# EAGLE design mymote-core (EAGLE 8.3.2)
PROJECT_AUTHOR: TINKERMAN <xose.perez@gmail.com>; PROJECT_LICENSE: CC-SA-BY 3.0; PROJECT_NAME: MYMOTE - CORE; PROJECT_VERSION: 0.3.20180204
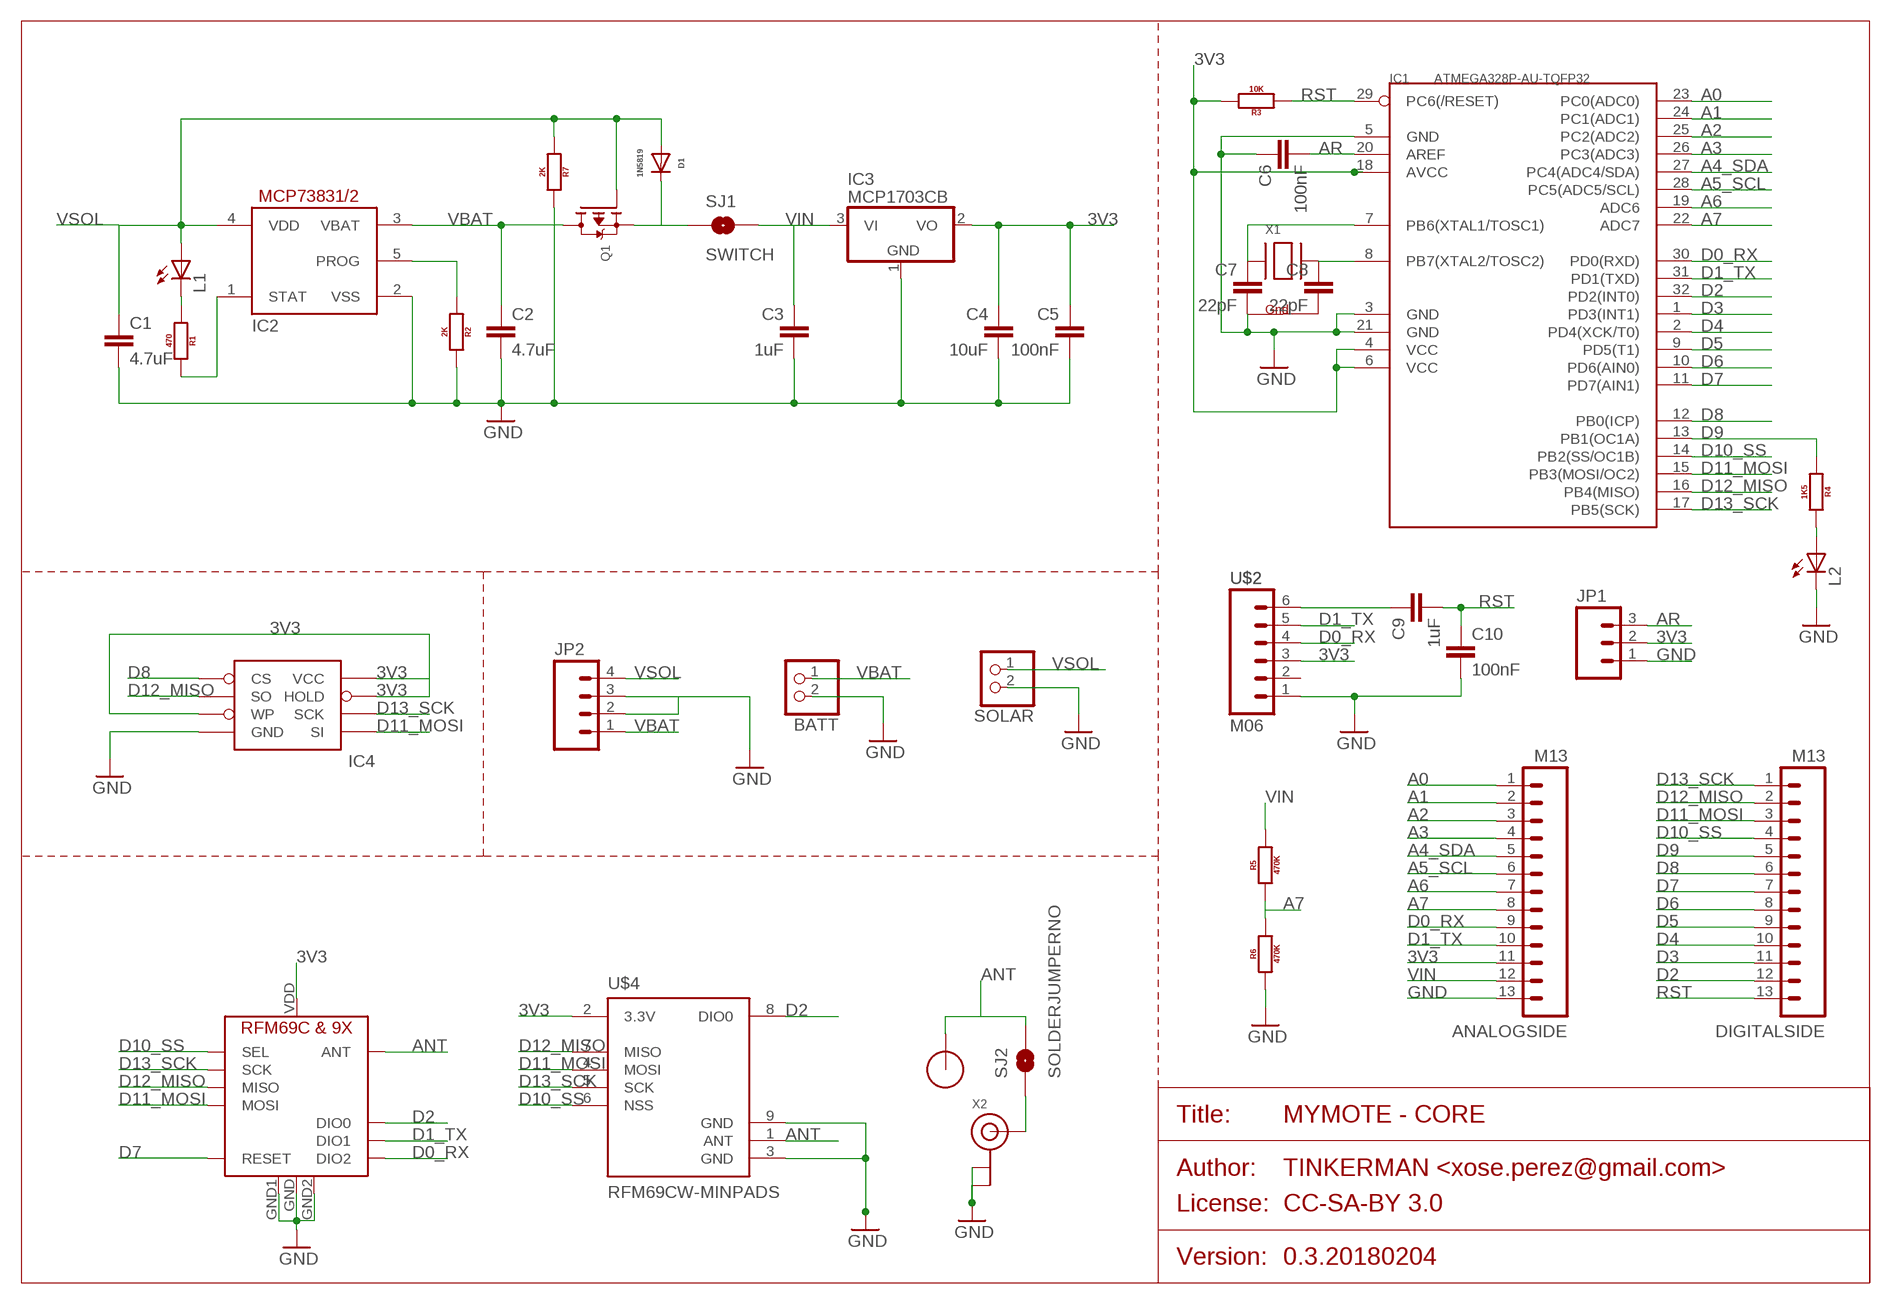
[diagram p0: schematic, sheet 1]

## Parts
ANALOGSIDE  M13  [1X13_NO_SILK]
BATT  JST_2PIN-SMT-RA  [JST-PH-2-SMT-RA]
C1  4.7uF  C-EU0805  [0805]
C2  4.7uF  C-EU0805  [0805]
C3  1uF  C-EU0805  [0805]
C4  10uF  C-EU0805  [0805]
C5  100nF  C-EU0805  [0805]
C6  100nF  C-EU0805  [0805]
C7  22pF  C-EU0805  [0805]
C8  22pF  C-EU0805  [0805]
C9  1uF  C-EU0805  [0805]
C10  100nF  C-EU0805  [0805]
D1  1N5819  DIODE-SMD  [0805_DIODE]
DIGITALSIDE  M13  [1X13_NO_SILK]
IC1  ATMEGA328P-AU-TQFP32  MCU-ATMEGA328P-AU(TQFP32)  [TQFP32-0.8-7X7MM]
IC2  MCP73831/OT  [SOT23-5L]
IC3  MCP1703CB  [SOT23]
IC4  AT25F512BWIDE_5.3MM  [SO08WIDE]
JP1  M03PTH  [1X03]
JP2  M04PTH  [1X04]
L1  LED_0805  [0805_DIODE]
L2  LED_0805  [0805_DIODE]
Q1  MOSFET-PWIDE  [SOT23-WIDE]
R1  470  RESISTOR0805  [0805]
R2  2K  RESISTOR0805  [0805]
R3  10K  RESISTOR0805  [0805]
R4  1K5  RESISTOR0805  [0805]
R5  470K  RESISTOR0805  [0805]
R6  470K  RESISTOR0805  [0805]
R7  2K  RESISTOR0805  [0805]
SJ1  SWITCH  SOLDERJUMPERTRACE-PTH  [SJ_2S-TRACE-PTH]
SJ2  SOLDERJUMPERNO  [SJ_2S-NO]
SOLAR  JST_2PIN-SMT-RA  [JST-PH-2-SMT-RA]
U$1  RFM12B_ANTENNA  [RFM12B-ANTENNA]
U$2  M06  [1X06_NO_SILK]
U$3  RFM69HCW-RFM95  [RFM69HCW-RFM95-MINPADS]
U$4  RFM69CW-MINPADS  [RFM69CW-MINPADS]
X1  XTAL-4-3225  [NX3225]
X2  ANTENNA_U.FL  [U.FL]

## Nets
3V3: ANALOGSIDE.11 C4.1 C5.1 IC1.4(VCC) IC1.6(VCC) IC1.18(AVCC) IC3.2(VO) IC4.3(WP) IC4.7(HOLD) IC4.8(VCC) JP1.2 R3.2 U$2.3 U$3.VDD(VCC) U$4.2(3.3V)
A0: ANALOGSIDE.1 IC1.23(PC0(ADC0))
A1: ANALOGSIDE.2 IC1.24(PC1(ADC1))
A2: ANALOGSIDE.3 IC1.25(PC2(ADC2))
A3: ANALOGSIDE.4 IC1.26(PC3(ADC3))
A4_SDA: ANALOGSIDE.5 IC1.27(PC4(ADC4/SDA))
A5_SCL: ANALOGSIDE.6 IC1.28(PC5(ADC5/SCL))
A6: ANALOGSIDE.7 IC1.19(ADC6)
A7: ANALOGSIDE.8 IC1.22(ADC7) R5.1 R6.2
ANT: SJ2.2 U$1.P$1 U$3.ANT U$4.1(ANT)
AR: C6.2 IC1.20(AREF) JP1.3
D0_RX: ANALOGSIDE.9 IC1.30(PD0(RXD)) U$2.4 U$3.DIO2
D1_TX: ANALOGSIDE.10 IC1.31(PD1(TXD)) U$2.5 U$3.DIO1
D2: DIGITALSIDE.12 IC1.32(PD2(INT0)) U$3.DIO0 U$4.8(DIO0)
D3: DIGITALSIDE.11 IC1.1(PD3(INT1))
D4: DIGITALSIDE.10 IC1.2(PD4(XCK/T0))
D5: DIGITALSIDE.9 IC1.9(PD5(T1))
D6: DIGITALSIDE.8 IC1.10(PD6(AIN0))
D7: DIGITALSIDE.7 IC1.11(PD7(AIN1)) U$3.RESET
D8: DIGITALSIDE.6 IC1.12(PB0(ICP)) IC4.1(CS)
D9: DIGITALSIDE.5 IC1.13(PB1(OC1A)) R4.1
D10_SS: DIGITALSIDE.4 IC1.14(PB2(SS/OC1B)) U$3.NSS(SEL) U$4.6(NSS)
D11_MOSI: DIGITALSIDE.3 IC1.15(PB3(MOSI/OC2)) IC4.5(SI) U$3.MOSI U$4.4(MOSI)
D12_MISO: DIGITALSIDE.2 IC1.16(PB4(MISO)) IC4.2(SO) U$3.MISO U$4.7(MISO)
D13_SCK: DIGITALSIDE.1 IC1.17(PB5(SCK)) IC4.6(SCK) U$3.SCK U$4.5(SCK)
GND [power]: ANALOGSIDE.13 BATT.2 C1.2 C2.2 C3.2 C4.2 C5.2 C6.1 C7.2 C10.2 IC1.3(GND) IC1.5(GND) IC1.21(GND) IC2.2(VSS) IC3.1(GND) IC4.4(GND) JP1.1 JP2.2 JP2.3 L2.C R2.2 R6.1 R7.2 SOLAR.2 U$2.1 U$3.GND U$3.GND1 U$3.GND2 U$4.3(GND) U$4.9(GND) X1.4(G1) X2.1(GND) X2.2(GND)
N$1: L2.A R4.2
N$2: L1.C R1.1
N$3: IC2.5(PROG) R2.1
N$4: IC2.1(STAT) R1.2
N$5: C7.1 IC1.7(PB6(XTAL1/TOSC1)) X1.1(X1)
N$7: C9.1 U$2.6
N$8: SJ2.1 X2.3(SIGNAL)
N$9: D1.C Q1.2(S) SJ1.1
N$11: C8.1 IC1.8(PB7(XTAL2/TOSC2)) X1.3(X2)
N$12: C8.2 X1.2(G2)
RST: C9.2 C10.1 DIGITALSIDE.13 IC1.29(PC6(/RESET)) R3.1
VBAT: BATT.1 C2.1 IC2.3(VBAT) JP2.1 Q1.3(D)
VIN: ANALOGSIDE.12 C3.1 IC3.3(VI) R5.2 SJ1.2
VSOL: C1.1 D1.A IC2.4(VDD) JP2.4 L1.A Q1.1(G) R7.1 SOLAR.1
Unconnected: U$2.2

## Library data of the parts
ANALOGSIDE DIGITALSIDE = xose:M13
BATT SOLAR = adafruit:JST_2PIN: JST 2-Pin Connectors of various flavors SMT-RA (S2B-PH-SM4) 4UConnector #17311 SMT (B2B-PH-SM4) THM-RA (S2B-PH) THM (B2B-PH)
C1-C10 = xose:C-EU: CAPACITOR, European symbol
D1 = xose:DIODE
IC1 = Seeed-IC-2016:MCU-ATMEGA328P-AU(TQFP32): 310010049; MPN: ATMEGA328P-AU
IC2 = adafruit:MCP73831: MCP73831/2 Miniature Single-Cell, Fully Integrated Li-Ion, Li-Polymer Charge Management Controllers. Nice and small simple lipoly charge controller, with adjustable current and status output (LED) http://www.ladyada.net/library/pcb/eaglelibrary.html
IC3 = xose:MCP1703: 250 mA, 16V, Low Quiescent Current LDO Regulator Source: http://ww1.microchip.com/downloads/en/DeviceDoc/22049b.pdf
IC4 = xose:AT25F512B: 4-Mbit SPI flash memory
JP1 = xose:M03: Header 3 Standard 3-pin 0.1" header. Use with straight break away headers (SKU : PRT-00116), right angle break away headers (PRT-00553), swiss pins (PRT-00743), machine pins (PRT-00117), and female headers (PRT-00115). Molex polarized connector foot print use with SKU : PRT-08232 with associated crimp pins and housings.
JP2 = xose:M04: Header 4 Standard 4-pin 0.1" header. Use with straight break away headers (SKU : PRT-00116), right angle break away headers (PRT-00553), swiss pins (PRT-00743), machine pins (PRT-00117), and female headers (PRT-00115). Molex polarized connector foot print use with SKU : PRT-08231 with associated crimp pins and housings. 1MM SMD Version SKU: PRT-10208
L1 L2 = xose:LED: LED OSRAM: - CHIPLED LG R971, LG N971, LY N971, LG Q971, LY Q971, LO R971, LY R971 LH N974, LH R974 LS Q976, LO Q976, LY Q976 LO Q996 - Hyper CHIPLED LW Q18S LB Q993, LB Q99A, LB R99A - SideLED LS A670, LO A670, LY A670, LG A670, LP A670 LB A673, LV A673, LT A673, LW A673 LH A674 LY A675 LS A676, LA A676, LO A676, LY A676, LW A676 LS A679, LY A679, LG A679 - Hyper Micro SIDELED® LS Y876, LA Y876, LO Y876, LY Y876 LT Y87S - SmartLED LW L88C, LW L88S LB L89C, LB L89S, LG L890 LS L89K, LO L89K, LY L89K LS L896, LA L896, LO L896, LY L896 - TOPLED LS T670, LO T670, LY T670, LG T670, LP T670 LSG T670, LSP T670, LSY T670, LOP T670, LYG T670 LG T671, LOG T671, LSG T671 LB T673, LV T673, LT T673, LW T673 LH T674 LS T676, LA T676, LO T676, LY T676, LB T676, LH T676, LSB T676, LW T676 LB T67C, LV T67C, LT T67C, LS T67K, LO T67K, LY T67K, LW E67C LS E67B, LA E67B, LO E67B, LY E67B, LB E67C, LV E67C, LT E67C LW T67C LS T679, LY T679, LG T679 LS T770, LO T770, LY T770, LG T770, LP T770 LB T773, LV T773, LT T773, LW T773 LH T774 LS E675, LA E675, LY E675, LS T675 LS T776, LA T776, LO T776, LY T776, LB T776 LHGB T686 LT T68C, LB T68C - Hyper Mini TOPLED® LB M676 - Mini TOPLED Santana® LG M470 LS M47K, LO M47K, LY M47K Source: http://www.osram.convergy.de LUXEON: - LUMILED® LXK2-PW12-R00, LXK2-PW12-S00, LXK2-PW14-U00, LXK2-PW14-V00 LXK2-PM12-R00, LXK2-PM12-S00, LXK2-PM14-U00 LXK2-PE12-Q00, LXK2-PE12-R00, LXK2-PE12-S00, LXK2-PE14-T00, LXK2-PE14-U00 LXK2-PB12-K00, LXK2-PB12-L00, LXK2-PB12-M00, LXK2-PB14-N00, LXK2-PB14-P00, LXK2-PB14-Q00 LXK2-PR12-L00, LXK2-PR12-M00, LXK2-PR14-Q00, LXK2-PR14-R00 LXK2-PD12-Q00, LXK2-PD12-R00, LXK2-PD12-S00 LXK2-PH12-R00, LXK2-PH12-S00 LXK2-PL12-P00, LXK2-PL12-Q00, LXK2-PL12-R00 Source: www.luxeon.com KINGBRIGHT: KA-3528ASYC Source: www.kingbright.com
Q1 = xose:MOSFET-P: P-Channel Mosfet LEGEND VDS: Voltage Drain-Source ID: Drain Current RDS(ON): Drain-Source On-State Resistance VGS(TH): Gate-Source Threshold Voltage CISS: Drain-Source Input Capacitance SOT-23 Name VDS ID RDS(ON) VGS(TH) CISS Order Number IRLML5103 30V 760mA 600 mOhm -- 75pF @ 25V Digikey: IRLML5103PBFCT-ND IRLML6401 12V 4.3A 50 mOhm 950mV @ 250µA 830pF @ 10V Digikey: IRLML6401PBFTR-ND NTR0202PL 20V 400mA 800 mOhm 2.3V @ 250uA 70pF @ 5V Digikey: NTR0202PLT1GOSTR-ND NTR4101PT1G 20V 1.8A 85 mOhm 1.2V @ 250uA 675pF @ 10V Digikey: NTR4101PT1GOSCT-ND DMP2004K 20V 600mA 900 mOhm 1V @ 250uA 175pF @ 16V Digikey: DMP2004KDICT-ND PMV65XP 20V 3.9A 76 mOhm 950mV @ 1mA 725pF @ 20V Digikey: 568-2358-2-ND TO-252 Name VDS ID RDS(ON) VGS(TH) CISS Order Number AOD417 30V 25A 34 mOhm 3V @ 250µA 920pF @ 15V Digikey: 785-1106-2-ND
R1-R7 = xose:RESISTOR: Generic EU resistor symbol
SJ1 SJ2 = xose:SOLDERJUMPER: Solder Jumper Standard SMD solder jumper. Used to automate production. Two varients : Normally Open and Normally Closed are the same, but have different paste layers. NC will have a large amount of paste and should jumper during reflow.
U$1 = LowPowerLab:RFM12B_ANTENNA
U$2 = xose:M06
U$3 = xose:RFM69HCW-RFM95
U$4 = xose:RFM69CW-MINPADS
X1 = adafruit:XTAL-4: Classic 4-pin 3.2 x 2.5mm crystal
X2 = adafruit:ANTENNA_U.FL: U.FL Antenna Connector

## Net classes
1 power: width 0.381 mm, clearance 0.254 mm

## Board
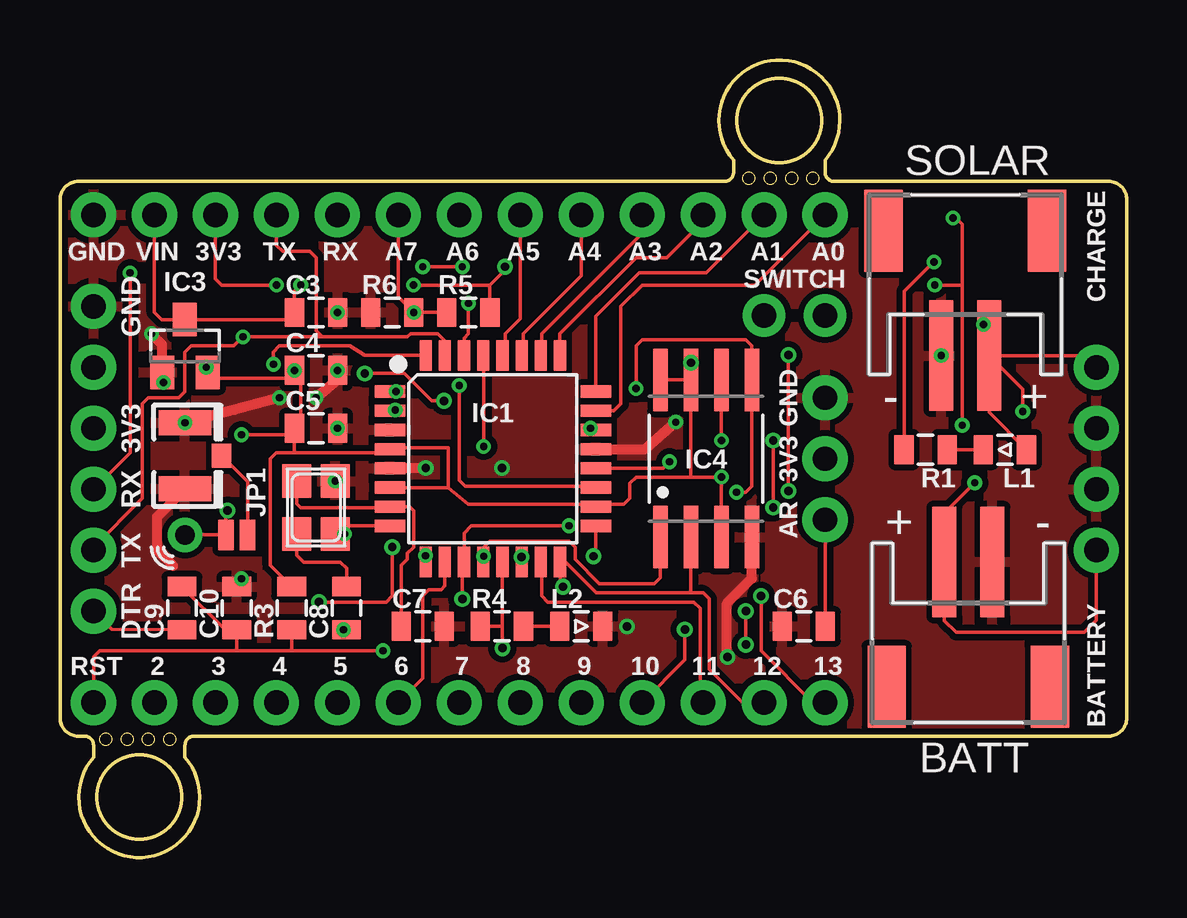
[diagram p1: board, top side]
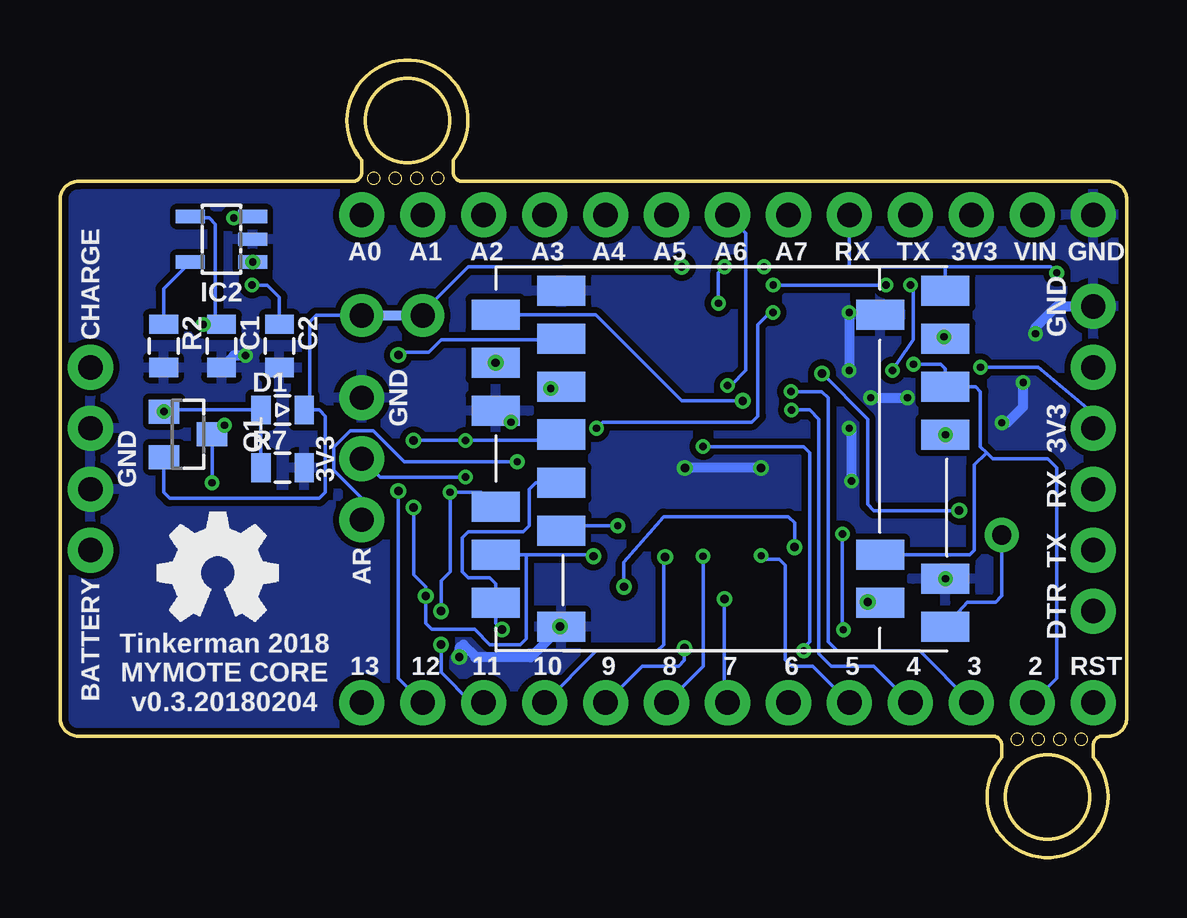
[diagram p2: board, bottom side, seen from below]

Size 44.45 x 33.23 mm. Coordinates in mm from the lower left corner, seen from the top.
Outline: 0.71,5.06 0.76,5.06
Outline: 0.76,28.17 0.71,28.17
Outline: 0,5.77 0,5.82
Outline: 0,27.41 0,27.46
Outline: 0,5.82 0,27.41
Outline: 0,27.41 arc-90 0.76,28.17
Outline: 0.76,5.06 1.02,5.06 arc-90 1.4,4.68 1.4,4.17 arc262 5.21,4.17 5.21,4.68 arc-90 5.59,5.06 43.69,5.06 arc90 44.45,5.82 44.45,27.41 arc90 43.69,28.17 32.26,28.17 arc-90 31.88,28.55 31.88,29.06 arc262 28.07,29.06 28.07,28.55 arc-90 27.69,28.17 0.76,28.17
Outline: 0.76,5.06 arc-90 0,5.82
Outline: circle at 3.3,2.52 radius 1.75
Outline: circle at 1.91,4.93 radius 0.25
Outline: circle at 2.79,4.93 radius 0.25
Outline: circle at 3.68,4.93 radius 0.25
Outline: circle at 29.97,30.71 radius 1.75
Outline: circle at 31.37,28.3 radius 0.25
Outline: circle at 30.48,28.3 radius 0.25
Outline: circle at 29.59,28.3 radius 0.25
Outline: circle at 4.57,4.93 radius 0.25
Outline: circle at 28.7,28.3 radius 0.25
Copper layers (1*16): Top 0.035mm / dielectric 1.5mm / Bottom 0.035mm
Design rules "seedstudio-2layer": minimum track width 6mil, minimum drill 12mil, track to track 6mil, track to pad 6mil, pad to pad 6mil, via to via 6mil, smd to smd 0mil, copper to edge 10mil, drill to drill 10mil, minimum pad ring 10mil, minimum via ring 6mil, stop-mask expansion 2mil, vias tented up to drill 100mil, thermal gap 10mil

### Footprints (pad centres in the part's own frame; a part is rotated, then mirrored left to right if it is on the bottom)
1X13_NO_SILK = drill 1.016 pad 1.88: 1 0,0; 2 2.54,0; 3 5.08,0; 4 7.62,0; 5 10.16,0; 6 12.7,0; 7 15.24,0; 8 17.78,0; 9 20.32,0; 10 22.86,0; 11 25.4,0; 12 27.94,0; 13 30.48,0
JST-PH-2-SMT-RA = smd 1 x 4.6: 1 1,-3.7; 2 -1,-3.7 | smd 1.6 x 3.4: NC1 -3.4,1.5; NC2 3.4,1.5
0805 = smd 0.8 x 1.2: 1 -0.9,0; 2 0.9,0
0805_DIODE = smd 0.8 x 1.2: A -0.9,0; C 0.9,0
TQFP32-0.8-7X7MM = smd 1.27 x 0.508: 1 -4.293,2.8; 2 -4.293,2; 3 -4.293,1.2; 4 -4.293,0.4; 5 -4.293,-0.4; 6 -4.293,-1.2; 7 -4.293,-2; 8 -4.293,-2.8; 17 4.293,-2.8; 18 4.293,-2; 19 4.293,-1.2; 20 4.293,-0.4; 21 4.293,0.4; 22 4.293,1.2; 23 4.293,2; 24 4.293,2.8 | smd 0.508 x 1.27: 9 -2.8,-4.293; 10 -2,-4.293; 11 -1.2,-4.293; 12 -0.4,-4.293; 13 0.4,-4.293; 14 1.2,-4.293; 15 2,-4.293; 16 2.8,-4.293; 25 2.8,4.293; 26 2,4.293; 27 1.2,4.293; 28 0.4,4.293; 29 -0.4,4.293; 30 -1.2,4.293; 31 -2,4.293; 32 -2.8,4.293
SOT23-5L = smd 0.55 x 1.2: 1 -0.95,-1.3; 2 0,-1.3; 3 0.95,-1.3; 4 0.95,1.3; 5 -0.95,1.3
SOT23 = smd 1 x 1.4: 1 -0.95,-1.1; 2 0.95,-1.1; 3 0,1.1
SO08WIDE = smd 0.61 x 2.6: 1 -1.905,-3.269; 2 -0.635,-3.269; 3 0.635,-3.269; 4 1.905,-3.269; 5 1.905,3.286; 6 0.635,3.286; 7 -0.635,3.286; 8 -1.905,3.286
1X03 = drill 1.016 pad 1.88: 1 0,0; 2 2.54,0; 3 5.08,0
1X04 = drill 1.016 pad 1.88: 1 0,0; 2 2.54,0; 3 5.08,0; 4 7.62,0
SOT23-WIDE = smd 1 x 1.27: 1 -0.95,-1; 2 0.95,-1; 3 0,1
SJ_2S-TRACE-PTH = drill 1.016 pad 1.778: 1 -1.27,0; 2 1.27,0 | smd 1.27 x 0.381 bottom: P$1 0,0
SJ_2S-NO = smd 0.635 x 1.27: 1 -0.45,0; 2 0.45,0
RFM12B-ANTENNA = drill 0.8 pad 1.422: P$1 0,0
1X06_NO_SILK = drill 1.016 pad 1.88: 1 0,0; 2 2.54,0; 3 5.08,0; 4 7.62,0; 5 10.16,0; 6 12.7,0
RFM69HCW-RFM95-MINPADS = smd 2 x 1.27: ANT 5.777,-7; DIO0 5.777,3; DIO1 5.779,5; DIO2 5.779,7; GND 5.777,-5; GND1 -10.223,7; GND2 -10.23,-7; MISO -10.23,5; MOSI -10.225,3; NSS -10.223,-1; RESET -10.223,-3; SCK -10.23,1.012; VDD 5.777,1
RFM69CW-MINPADS = smd 2 x 1.27: 1 -8.008,6; 2 -8.008,4; 3 -8.008,2; 4 -8.008,-2; 5 -8.008,-4; 6 -8.008,-6; 7 8.008,-6; 8 8.008,-4; 9 8.008,6
NX3225 = smd 1.4 x 1.2: 1 -1.1,-0.8; 2 1.1,-0.8; 3 1.1,0.8; 4 -1.1,0.8
U.FL = smd 2.2 x 1.05: 1 0,1.375; 2 0,-1.375 | smd 0.8 x 1: 3 1.525,0

### Placement (x,y rotation side)
ANALOGSIDE  31.88,26.77 180 top
BATT  37.85,8.61 180 top
C1  37.72,21.31 270 bottom
C2  35.31,21.31 270 bottom
C3  10.67,22.71 0 top
C4  10.67,20.3 0 top
C5  10.67,17.88 0 top
C6  30.99,9.63 0 top
C7  15.11,9.63 0 top
C8  11.94,10.39 90 top
C9  5.08,10.39 90 top
C10  7.37,10.39 90 top
D1  35.18,18.65 0 bottom
DIGITALSIDE  31.88,6.45 180 top
IC1  18.03,16.61 0 top
IC2  37.72,25.76 90 bottom
IC3  5.21,21.31 0 top
IC4  26.92,16.61 0 top
JP1  31.88,19.15 270 top
JP2  43.18,12.8 90 top
L1  39.37,17 180 top
L2  21.72,9.63 0 top
Q1  39.12,17.63 270 bottom
R1  36.07,17 180 top
R2  40.13,21.31 270 bottom
R3  9.65,10.39 90 top
R4  18.41,9.63 0 top
R5  17.02,22.71 0 top
R6  13.84,22.71 0 top
R7  35.18,16.23 0 bottom
SJ1  30.61,22.58 180 top
SJ2  7.37,13.44 180 top
SOLAR  37.72,24.62 0 top
U$1  5.21,13.44 0 top
U$2  1.4,22.96 270 top
U$3  13.34,16.61 0 bottom
U$4  18.29,16.61 0 bottom
X1  10.67,14.58 270 top
X2  5.21,16.74 0 top

### Tracks (layer width: path | path; a pad name or v marks a point on that pad's centre or on a via)
3V3  (via drill 0.3, 0.35)
  Top 0.152: IC4.3 v27.56,15.85 26.29,15.85 | IC4.8 IC4.7 | 26.29,15.85 24,15.85 23.75,15.6 23.75,14.96 23.5,14.71 22.42,14.71 IC1.18 22.23,14.71 17.02,14.71 16.19,15.41 | 16.19,15.41 IC1.6 | IC1.4 13.85,17.12 | 16.19,15.41 16.19,17.07 13.79,17.07 IC1.4 | IC1.4 13.72,16.87 | v6.1,20.42 6.16,20.1 IC3.2 6.41,19.96 9.68,19.96 C4.1 9.77,20.05 10.03,19.79 10.03,18.15 C5.1 | R3.2 8.76,12.18 8.76,16.61 9.02,16.87 9.78,16.87 | 13.61,16.88 IC1.4 | IC1.4 13.6,16.87 9.78,16.87 | C5.1 9.77,16.88 9.78,16.87 | U$3.VDD 9.5,17.61 C5.1 | ANALOGSIDE.11 6.48,24.11 6.73,23.85 v9.02,23.85 | IC4.7 26.29,15.85 | IC4.7 U$4.2
  Bottom 0.152: U$2.3 1.4,18.52 3.68,20.42 v6.1,20.42 | v9.02,23.85 8.89,23.73 8.89,21.58 C4.1 | v27.56,15.85 31.11,15.85 JP1.2
  other vias: 7.56,17.61 9.77,20.3 26.3,20.61
A0
  Top 0.152: IC1.23 23.08,18.61 23.37,18.9 23.37,22.96 24.26,23.85 28.96,23.85 ANALOGSIDE.1
A1
  Top 0.152: IC1.24 22.33,22.56 24.13,24.36 26.92,24.36 ANALOGSIDE.2
A2
  Top 0.152: IC1.25 20.83,21.82 24,25 25.27,25 26.8,26.52 ANALOGSIDE.3
A3
  Top 0.152: IC1.26 20.07,20.94 20.07,21.82 24.26,26.01 ANALOGSIDE.4
A4_SDA
  Top 0.152: IC1.27 19.3,20.98 19.3,21.82 21.72,24.23 ANALOGSIDE.5
A5_SCL
  Top 0.152: IC1.28 18.54,21.02 18.54,21.82 19.18,22.46 ANALOGSIDE.6
A6  (via drill 0.3)
  Top 0.152: IC1.19 22.41,15.41 22.35,15.47 16.89,15.47 16.64,15.73 v16.64,19.66
  Bottom 0.152: ANALOGSIDE.7 15.88,26.01 15.88,20.3 16.51,19.66 v16.64,19.66
A7  (via drill 0.3)
  Top 0.152: R5.1 R6.2 14.1,23.36 ANALOGSIDE.8 | v22.1,17.88 22.27,17.88 IC1.22
  Bottom 0.152: v22.1,17.88 21.84,18.14 15.62,18.14 15.37,18.39 15.37,22.2 14.86,22.71 R6.2
  other vias: 14.74,22.71
ANT  (via drill 0.35)
  Top 0.152: U$1.P$1 SJ2.2 6.92,14.39 v6.99,14.46 | v16,19.03 15.49,19.03 14.35,20.17 v12.7,20.17
  Bottom 0.152: U$3.ANT 6.65,10.65 5.46,10.65 5.21,10.9 U$1.P$1 | U$4.1 22.13,22.61 18.54,19.03 v16,19.03 | v6.99,14.46 10.54,14.46 10.79,14.71 10.79,18.27 v12.7,20.17
AR  (via drill 0.3)
  Top 0.152: JP1.3 31.88,9.64 C6.2 | IC1.20 25.13,16.21 v25.4,16.49
  Bottom 0.152: v25.4,16.49 30.1,16.49 31.39,17.78 32.36,17.78 33.05,17.1 33.05,16.13 31.88,14.96 JP1.3
D0_RX  (via drill 0.3)
  Top 0.152: IC1.30 16.83,21.64 17.02,21.82 v17.02,23.09 | v16.76,24.62 v15.11,24.62 | v2.92,24.36 2.92,16.87 U$2.4
  Bottom 0.152: v17.02,23.09 17.02,24.36 v16.76,24.62 | v2.92,24.36 3.17,24.62 7.56,24.62 | 7.56,24.62 11.56,24.62 | 11.56,24.62 v15.11,24.62 | ANALOGSIDE.9 11.56,24.62 | U$3.DIO2 7.56,24.62
D1_TX  (via drill 0.3)
  Top 0.152: IC1.31 16.03,21.54 15.75,21.82 14.61,21.82 14.48,21.69 10.92,21.69 | 10.92,21.69 10.67,21.95 10.67,25 10.41,25.25 9.27,25.25 9.02,25.5 ANALOGSIDE.10 | 10.92,21.69 v7.62,21.69 7.24,21.31 5.46,21.31 5.21,21.06 5.21,19.41 4.95,19.15 3.68,19.15 3.43,18.9 3.43,14.96 1.4,12.93 U$2.5
  Bottom 0.152: U$3.DIO1 7.56,21.63 v7.62,21.69
D2  (via drill 0.3)
  Top 0.152: IC1.32 15.21,20.93 12.7,20.93 12.06,21.31 9.14,21.31 8.89,21.06 v8.89,20.55
  Bottom 0.152: U$3.DIO0 8.14,19.66 | 7,19.66 U$3.DIO0 | DIGITALSIDE.12 2.92,7.47 2.92,16.23 3.3,16.61 5.59,16.61 5.84,16.87 | U$3.DIO0 6.3,19.61 6.1,19.41 6.1,17.12 5.84,16.87 | U$3.DIO0 7.56,20.36 7.75,20.55 v8.89,20.55 | U$4.8 6.54,12.61 6.35,12.8 6.35,16.36 5.84,16.87
D3  (via drill 0.3)
  Top 0.152: IC1.1 v13.99,19.41
  Bottom 0.152: v13.99,19.41 12.71,19.41 12.45,19.15 12.45,8.99 12.06,8.61 8.64,8.61 DIGITALSIDE.11
D4  (via drill 0.3)
  Top 0.152: IC1.2 arc90 13.71,18.65 v13.97,18.65
  Bottom 0.152: DIGITALSIDE.10 10.54,7.98 12.32,7.98 12.83,8.49 12.83,18.27 13.21,18.65 v13.97,18.65
D5  (via drill 0.3)
  Top 0.152: IC1.9 v15.23,12.58
  Bottom 0.152: v15.23,12.58 15.13,12.42 14.48,12.42 14.22,12.17 14.22,8.23 13.97,7.98 13.08,7.98 DIGITALSIDE.9
D6
  Top 0.152: IC1.10 16.03,11.31 15.88,11.15 15.37,11.15 15.11,10.9 15.11,7.47 DIGITALSIDE.8
D7  (via drill 0.3, 0.35)
  Top 0.152: v16.76,10.77 16.76,12.17 16.89,12.26 IC1.11 16.83,13.51 17.14,13.82 v21.21,13.82
  Bottom 0.152: DIGITALSIDE.7 16.76,6.71 v16.76,10.77 | 23.57,13.63 U$3.RESET 23.35,13.82 v21.21,13.82
D8  (via drill 0.3)
  Top 0.152: 25.24,13.19 IC4.1 25.02,11.66 24.77,11.41 22.48,11.41 21.46,12.42 21.46,12.93 21.21,13.19 17.91,13.19 17.63,12.91 IC1.12 v17.65,12.55
  Bottom 0.152: v17.65,12.55 17.65,7.98 DIGITALSIDE.6
D9  (via drill 0.35)
  Top 0.152: R4.1 18.43,9.63 | 18.43,9.63 v18.43,8.72 | 18.43,9.63 IC1.13
  Bottom 0.152: DIGITALSIDE.5 20.19,7.98 18.67,7.98 18.43,8.21 v18.43,8.72
D10_SS  (via drill 0.35)
  Top 0.152: DIGITALSIDE.4 26.04,8.23 v26.04,9.5 | IC1.14 v19.23,12.53
  Bottom 0.152: U$3.NSS 24.62,15.61 24.89,15.34 24.89,13.82 25.15,13.57 27.43,13.57 27.69,13.31 27.69,11.92 27.43,11.66 26.54,11.66 26.3,11.41 U$4.6 26.3,9.76 v26.04,9.5 | DIGITALSIDE.4 22.1,8.61 19.56,8.61 19.3,8.87 19.3,12.68 19.23,12.61 v19.23,12.53
D11_MOSI  (via drill 0.3, 0.35)
  Top 0.152: v24,19.54 24,21.31 24.26,21.57 28.57,21.57 28.83,21.31 IC4.5 28.83,15.47 28.57,15.22 v28.19,15.22 | IC1.15 20.07,12.29 20.07,10.9 20.32,10.65 26.42,10.65 26.67,10.39 26.67,6.58 DIGITALSIDE.3 | v28.57,10.26 v28.57,8.87
  Bottom 0.152: U$3.MOSI 24.18,19.61 v24,19.54 | U$4.4 26.9,15.22 v28.19,15.22 28.19,11.92 28.57,11.53 v28.57,10.26 | 28.57,8.36 28.57,8.23 | 28.57,8.36 v28.57,8.87 | DIGITALSIDE.3 27.3,6.45 28.57,7.72 28.57,8.36
D12_MISO  (via drill 0.35)
  Top 0.152: IC1.16 21.06,12.32 22.35,11.03 26.29,11.03 | 26.29,11.03 IC4.2 | 26.29,11.03 26.8,11.03 27.05,10.77 27.05,7.85 28.45,6.45 DIGITALSIDE.2 | IC1.16 | v10.79,10.65 13.59,10.65 13.84,10.9 v13.84,12.93 | IC1.16 20.83,11.4 v20.95,11.28 | v30.35,15.28 v30.35,20.93
  Bottom 0.152: U$4.7 10.76,10.61 v10.79,10.65 | v20.95,11.28 20.95,12.3 19.3,14.2 14.1,14.2 13.84,13.95 v13.84,12.93 | U$3.MISO 23.61,21.57 28.57,21.57 29.08,21.06 30.23,21.06 v30.35,20.93 | DIGITALSIDE.2 30.35,7.47 v30.35,15.28
D13_SCK  (via drill 0.3, 0.35)
  Top 0.152: 22.35,13.81 IC1.17 22.33,12.78 v22.23,12.55 | IC4.6 v27.56,17.38 | v29.72,17.38 v29.72,14.58 | v29.21,10.9 29.21,8.61 31.37,6.45 DIGITALSIDE.1
  Bottom 0.152: U$3.SCK 23.82,17.38 v27.56,17.38 v29.72,17.38 | 25.02,12.61 U$4.5 | 25.02,12.61 22.29,12.61 v22.23,12.55 | 25.02,12.61 25.02,9.12 25.27,8.87 26.54,8.87 27.18,9.5 28.96,9.5 29.21,9.76 v29.21,10.9 29.21,11.28 29.72,11.79 v29.72,14.58
GND  (via drill 0.3, 0.35)
  Top 0.406: v4.32,19.79 4.32,20.15 IC3.1 4.26,21.37 v3.81,21.82 | C4.2 11.57,19.93 v10.67,19.15 | v9.14,19.15 7.26,18.65 X2.1 | C10.2 7.56,11.48 U$3.GND | 4.72,12.15 4.04,12.83 4.04,14.18 5.21,15.35 X2.2 | IC1.21 24.38,17.01 v25.65,18.14 | IC1.5 13.76,16.23 v15.24,16.23 | IC4.4 28.83,11.63 27.79,10.59 27.79,8.54 27.81,8.52 v27.81,8.36
  Bottom 0.406: X2.1 4.97,18.12 4.32,18.77 v4.32,19.79 | X1.4 11.47,17.78 C5.2 | C3.2 C4.2 | v10.67,19.15 v9.14,19.15 | SOLAR.2 37.22,20.92 C1.2 | v3.81,21.82 3.81,22.08 2.92,22.96 U$2.1 | U$4.3 25.98,18.61 v25.65,18.14 | v15.24,16.23 v18.41,16.23 | v23.62,9.63 23.58,9.63 U$3.GND2 24.84,8.33 27.11,8.33 | 27.13,8.31 27.11,8.33 | 27.11,8.33 27.64,8.87 v27.81,8.36 | v27.81,8.36 27.79,8.76 27.79,8.54 27.81,8.52 v27.81,8.36
  other vias: 5.21,18.12 11.47,15.68 11.57,17.88 11.57,20.3 11.57,22.71 36.72,20.92 7.56,11.61
  pour Top (isolate 0.025): -0.76,29.7 44.83,29.7 44.96,4.55 -0.64,4.55
  pour Bottom (isolate 0.025): -0.13,28.93 44.58,28.93 44.45,4.8 -0.25,4.8
N$1
  Top 0.152: L2.A R4.2
N$2
  Top 0.152: R1.1 L1.C
N$3
  Bottom 0.152: IC2.5 40.13,23.7 R2.1
N$4  (via drill 0.3)
  Top 0.152: IC2.1 36.39,24.81 35.18,23.6 R1.2
  other vias: 36.42,24.81
N$5
  Top 0.152: C7.1 14.22,9.64 14.22,12.17 14.48,12.42 14.48,12.68 14.73,12.93 14.73,14.46 14.57,14.61 IC1.7 13.71,14.58 10.03,14.58 9.87,14.75 X1.1
N$7
  Top 0.152: C9.1 2.16,9.5 U$2.6
N$8
  Top 0.152: SJ2.1 7.82,15.66 X2.3
N$9
  Bottom 0.152: 34.04,18.65 D1.C | 34.04,18.65 33.66,18.65 33.4,18.39 33.4,15.22 33.66,14.96 39.88,14.96 40.13,15.22 40.13,16.66 Q1.2 | SJ1.1 33.78,22.58 34.04,22.33 34.04,18.65
N$11  (via drill 0.3)
  Top 0.152: IC1.8 11.8,13.81 v11.85,13.48 X1.3 | C8.1 v11.81,9.49
  Bottom 0.152: v11.85,13.48 11.85,9.81 v11.81,9.49
N$12
  Top 0.152: C8.2 11.94,12.04 11.68,12.3 10.16,12.3 9.87,12.59 X1.2
RST  (via drill 0.3)
  Top 0.152: DIGITALSIDE.13 1.4,8.36 1.65,8.61 7.37,8.61 | 7.37,8.61 9.65,8.61 | 9.65,8.61 v13.46,8.61 | IC1.29 17.65,20.89 v17.65,17.12 | R3.1 9.65,8.61 | C9.2 6.88,9.49 C10.1 7.37,8.61
  Bottom 0.152: v17.65,17.12 13.46,17.12 13.21,16.87 13.21,8.99 13.46,8.74 v13.46,8.61
VBAT  (via drill 0.3)
  Top 0.152: JP2.1 43.18,9.88 42.67,9.38 37.34,9.38 36.85,9.87 BATT.1 36.85,14.31 36.83,14.33 v38.12,15.61 | v37.21,26.65 37.34,26.65 37.59,26.39 37.59,23.85 | 37.59,23.85 v37.59,18.01 | v36.45,23.85 37.59,23.85
  Bottom 0.152: v38.12,15.61 Q1.3 37.73,18.01 v37.59,18.01 | 36.36,26.65 IC2.3 37.15,26.71 v37.21,26.65 | C2.1 35.31,23.35 35.81,23.85 v36.45,23.85
VIN  (via drill 0.3, 0.35)
  Top 0.152: ANALOGSIDE.12 3.94,22.71 4.23,22.41 IC3.3 9.47,22.41 C3.1 9.77,23.59 v10.03,23.85 | v14.73,23.85 17.91,23.85 | 17.91,23.85 17.91,22.72 R5.2 | 17.91,23.85 18.54,24.49 v18.54,24.62
  Bottom 0.152: v10.03,23.85 v14.73,23.85 | SJ1.2 29.34,22.71 27.43,24.62 v18.54,24.62
VSOL  (via drill 0.3)
  Top 0.152: v38.48,22.2 38.48,21.15 SOLAR.1 | L1.A 38.72,18.55 SOLAR.1 | SOLAR.1 42.69,20.92 JP2.4 | SOLAR.1 40.12,19.52 Q1.1
  Bottom 0.152: IC2.4 38.96,26.65 38.23,26.65 37.97,26.39 37.97,22.47 C1.1 38.47,22.21 v38.48,22.2 | Q1.1 40.05,18.65 D1.A R7.1
  other vias: 40.12,18.58

### Text on the board
tNames: CHARGE | GND | VIN | 3V3 | TX | RX | A7 | A6 | A5 | A4 | A3 | A2 | A1 | A0 | SWITCH | GND | GND | 3V3 | 3V3 | RX | JP1 | AR | TX | DTR | RST | 2 | 3 | 4 | 5 | 6 | 7 | 8 | 9 | 10 | 11 | 12 | 13 | BATTERY
bNames: GND | VIN | 3V3 | TX | RX | A7 | A6 | A5 | A4 | A3 | A2 | A1 | A0 | GND | CHARGE | GND | 3V3 | 3V3 | GND | RX | TX | AR | BATTERY | DTR | RST | 2 | 3 | 4 | 5 | 6 | 7 | 8 | 9 | 10 | 11 | 12 | 13 | Tinkerman 2018 / MYMOTE CORE / v0.3.20180204